# Altium schematic sheet Rangefinders.SchDoc: [Untitled]
size A3; Author: Nędzny Janusz; CompanyName: SensDx S.A.; Organization: SensDx S.A.; Address1: Wrocław Laboratories; SheetNumber: 1; SheetTotal: 1
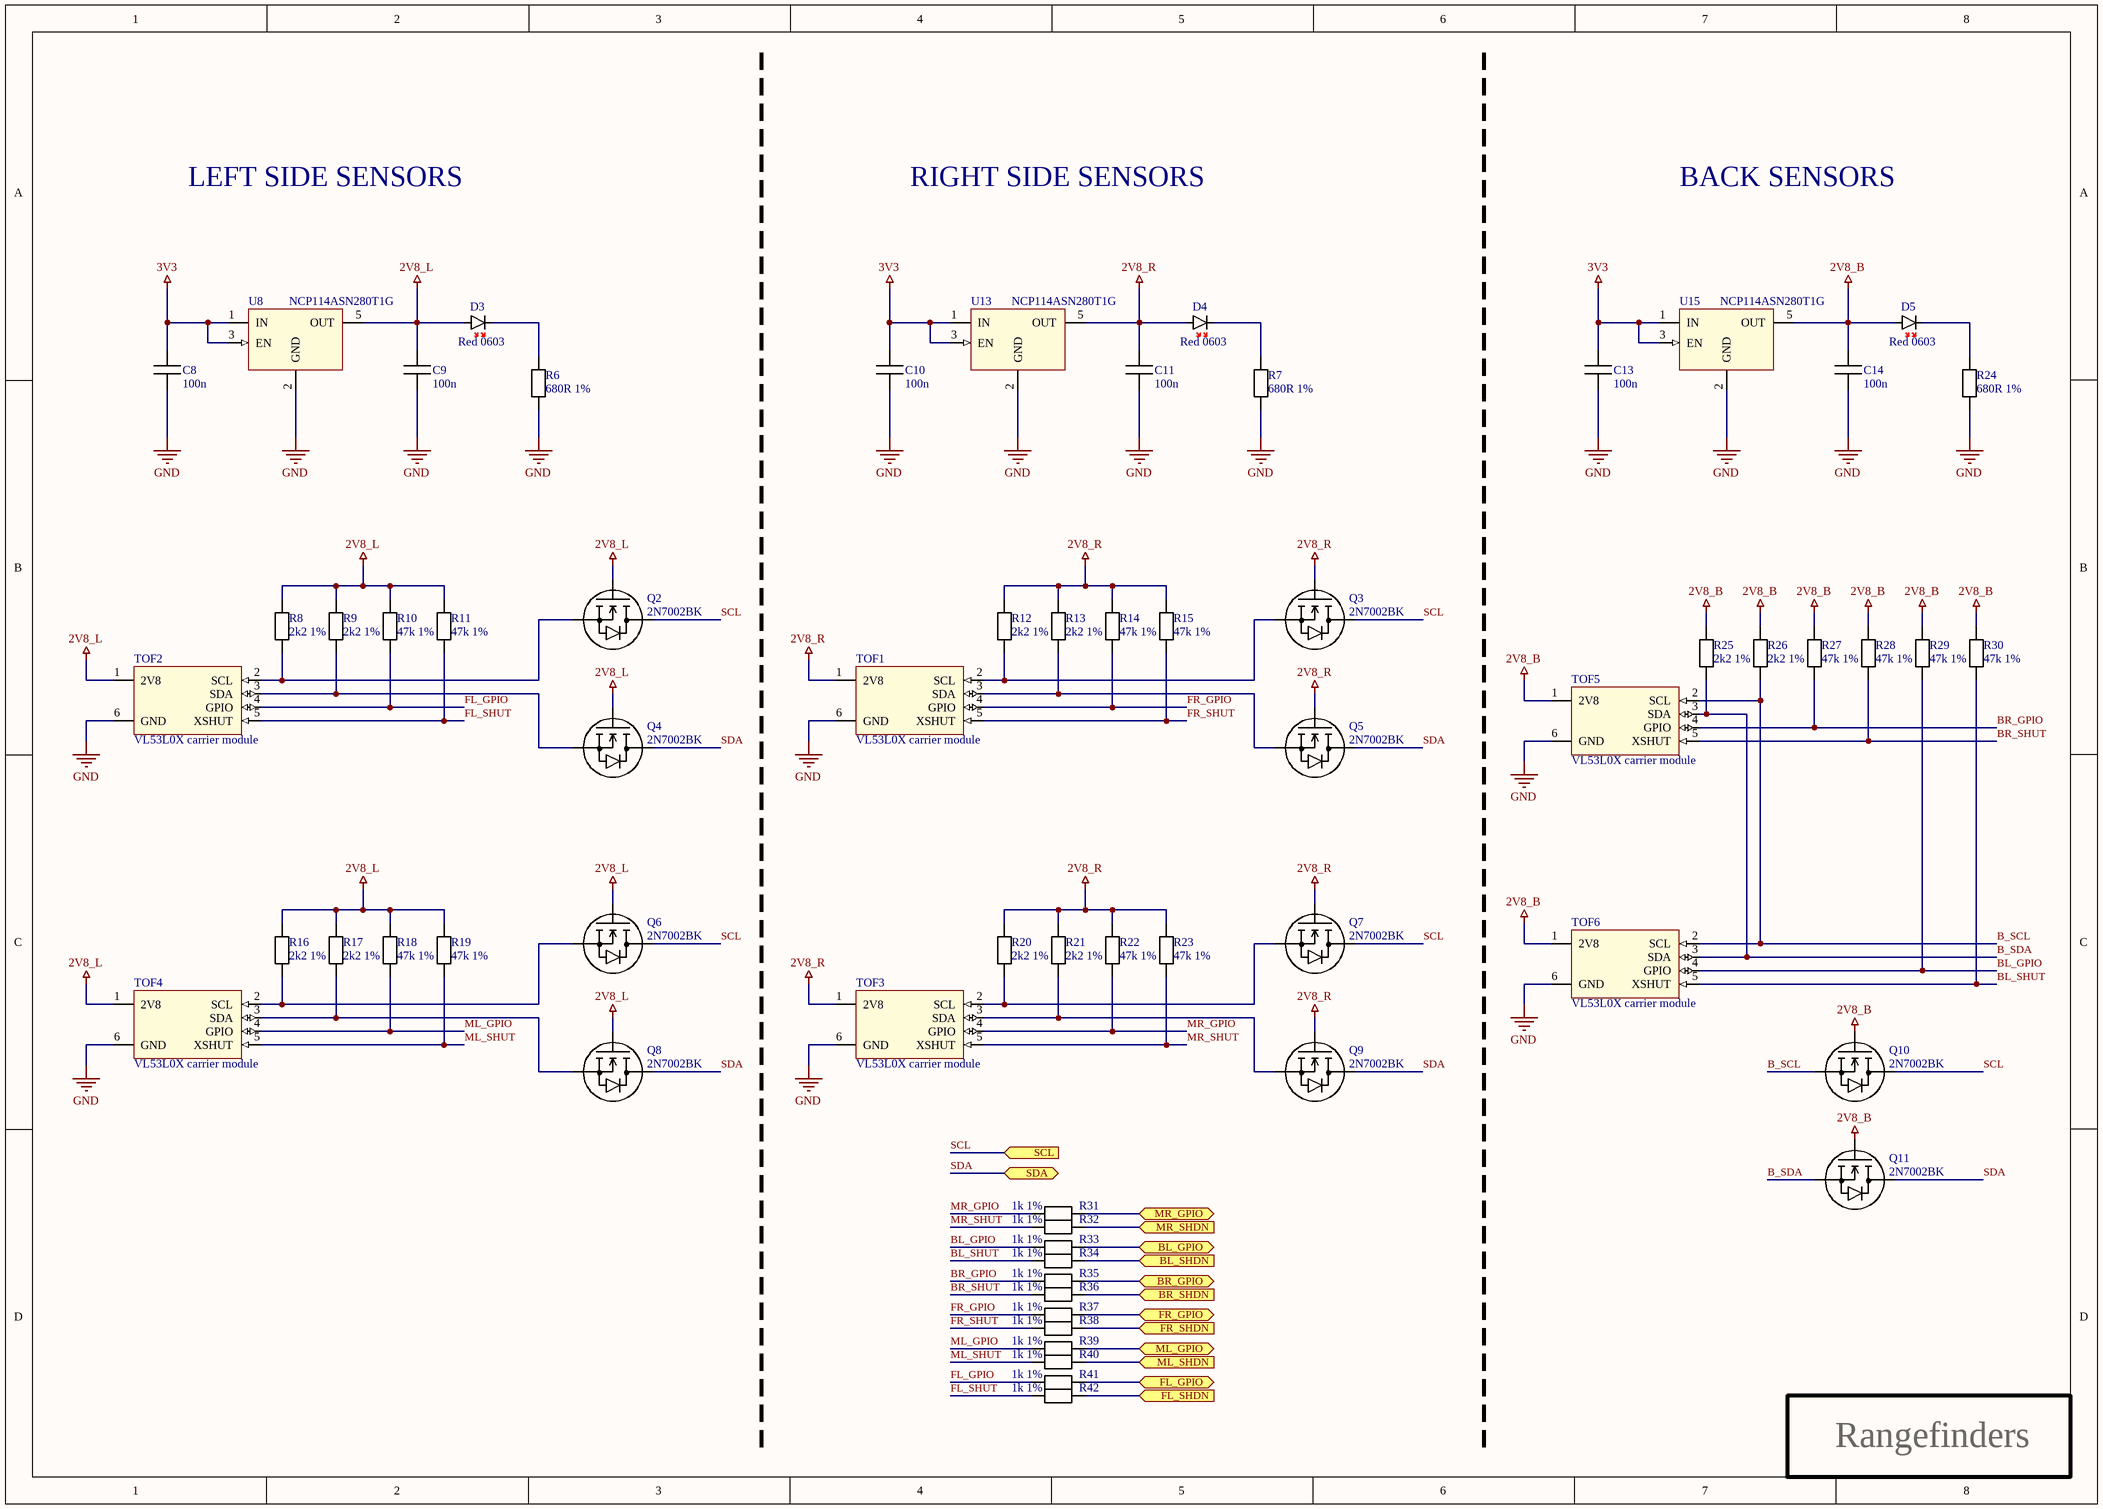
[diagram p0: Rangefinders.SchDoc]

## Parts
C8  100n  [C_0603_AUTO]
C9  100n  [C_0603_AUTO]
C10  100n  [C_0603_AUTO]
C11  100n  [C_0603_AUTO]
C13  100n  [C_0603_AUTO]
C14  100n  [C_0603_AUTO]
D3  Red 0603  [LED_0603_AUTO]
D4  Red 0603  [LED_0603_AUTO]
D5  Red 0603  [LED_0603_AUTO]
Q2  2N7002BK  [SOT23-3_AUTO]
Q3  2N7002BK  [SOT23-3_AUTO]
Q4  2N7002BK  [SOT23-3_AUTO]
Q5  2N7002BK  [SOT23-3_AUTO]
Q6  2N7002BK  [SOT23-3_AUTO]
Q7  2N7002BK  [SOT23-3_AUTO]
Q8  2N7002BK  [SOT23-3_AUTO]
Q9  2N7002BK  [SOT23-3_AUTO]
Q10  2N7002BK  [SOT23-3_AUTO]
Q11  2N7002BK  [SOT23-3_AUTO]
R6  680R 1%  [R_0603_AUTO]
R7  680R 1%  [R_0603_AUTO]
R8  2k2 1%  [R_0603_AUTO]
R9  2k2 1%  [R_0603_AUTO]
R10  47k 1%  [R_0603_AUTO]
R11  47k 1%  [R_0603_AUTO]
R12  2k2 1%  [R_0603_AUTO]
R13  2k2 1%  [R_0603_AUTO]
R14  47k 1%  [R_0603_AUTO]
R15  47k 1%  [R_0603_AUTO]
R16  2k2 1%  [R_0603_AUTO]
R17  2k2 1%  [R_0603_AUTO]
R18  47k 1%  [R_0603_AUTO]
R19  47k 1%  [R_0603_AUTO]
R20  2k2 1%  [R_0603_AUTO]
R21  2k2 1%  [R_0603_AUTO]
R22  47k 1%  [R_0603_AUTO]
R23  47k 1%  [R_0603_AUTO]
R24  680R 1%  [R_0603_AUTO]
R25  2k2 1%  [R_0603_AUTO]
R26  2k2 1%  [R_0603_AUTO]
R27  47k 1%  [R_0603_AUTO]
R28  47k 1%  [R_0603_AUTO]
R29  47k 1%  [R_0603_AUTO]
R30  47k 1%  [R_0603_AUTO]
R31  1k 1%  [R_0603_AUTO]
R32  1k 1%  [R_0603_AUTO]
R33  1k 1%  [R_0603_AUTO]
R34  1k 1%  [R_0603_AUTO]
R35  1k 1%  [R_0603_AUTO]
R36  1k 1%  [R_0603_AUTO]
R37  1k 1%  [R_0603_AUTO]
R38  1k 1%  [R_0603_AUTO]
R39  1k 1%  [R_0603_AUTO]
R40  1k 1%  [R_0603_AUTO]
R41  1k 1%  [R_0603_AUTO]
R42  1k 1%  [R_0603_AUTO]
TOF1  VL53L0X carrier module  [VL53L0X_module]
TOF2  VL53L0X carrier module  [VL53L0X_module]
TOF3  VL53L0X carrier module  [VL53L0X_module]
TOF4  VL53L0X carrier module  [VL53L0X_module]
TOF5  VL53L0X carrier module  [VL53L0X_module]
TOF6  VL53L0X carrier module  [VL53L0X_module]
U8  NCP114ASN280T1G  [TSOP-5_AUTO]
U13  NCP114ASN280T1G  [TSOP-5_AUTO]
U15  NCP114ASN280T1G  [TSOP-5_AUTO]

## Ports
BL_GPIO (bidir), BL_SHDN (in), BR_GPIO (bidir), BR_SHDN (in), FL_GPIO (bidir), FL_SHDN (in), FR_GPIO (bidir), FR_SHDN (in), ML_GPIO (bidir), ML_SHDN (in), MR_GPIO (bidir), MR_SHDN (in), SCL (in), SDA (bidir)

## Nets
2V8_B: C14.2 D5.2(A) Q10.1(G) Q11.1(G) R25.2 R26.2 R27.2 R28.2 R29.2 R30.2 TOF5.1(2V8) TOF6.1(2V8) U15.5(OUT)
2V8_L: C9.2 D3.2(A) Q2.1(G) Q4.1(G) Q6.1(G) Q8.1(G) R8.2 R9.2 R10.2 R11.2 R16.2 R17.2 R18.2 R19.2 TOF2.1(2V8) TOF4.1(2V8) U8.5(OUT)
2V8_R: C11.2 D4.2(A) Q3.1(G) Q5.1(G) Q7.1(G) Q9.1(G) R12.2 R13.2 R14.2 R15.2 R20.2 R21.2 R22.2 R23.2 TOF1.1(2V8) TOF3.1(2V8) U13.5(OUT)
3V3: C8.2 C10.2 C13.2 U8.1(IN) U8.3(EN) U13.1(IN) U13.3(EN) U15.1(IN) U15.3(EN)
GND: C8.1 C9.1 C10.1 C11.1 C13.1 C14.1 R6.1 R7.1 R24.1 TOF1.6(GND) TOF2.6(GND) TOF3.6(GND) TOF4.6(GND) TOF5.6(GND) TOF6.6(GND) U8.2(GND) U13.2(GND) U15.2(GND)
B_SCL: Q10.2(S) R26.1 TOF5.2(SCL) TOF6.2(SCL)
B_SDA: Q11.2(S) R25.1 TOF5.3(SDA) TOF6.3(SDA)
BL_GPIO: R29.1 R33.2 TOF6.4(GPIO)
BL_GPIO: R33.1 ; port BL_GPIO  [a separate net that carries the same name]
BL_SHDN: R34.1 ; port BL_SHDN
BL_SHUT: R30.1 R34.2 TOF6.5(XSHUT)
BR_GPIO: R27.1 R35.2 TOF5.4(GPIO)
BR_GPIO: R35.1 ; port BR_GPIO  [a separate net that carries the same name]
BR_SHDN: R36.1 ; port BR_SHDN
BR_SHUT: R28.1 R36.2 TOF5.5(XSHUT)
FL_GPIO: R10.1 R41.2 TOF2.4(GPIO)
FL_GPIO: R41.1 ; port FL_GPIO  [a separate net that carries the same name]
FL_SHDN: R42.1 ; port FL_SHDN
FL_SHUT: R11.1 R42.2 TOF2.5(XSHUT)
FR_GPIO: R14.1 R37.2 TOF1.4(GPIO)
FR_GPIO: R37.1 ; port FR_GPIO  [a separate net that carries the same name]
FR_SHDN: R38.1 ; port FR_SHDN
FR_SHUT: R15.1 R38.2 TOF1.5(XSHUT)
ML_GPIO: R18.1 R39.2 TOF4.4(GPIO)
ML_GPIO: R39.1 ; port ML_GPIO  [a separate net that carries the same name]
ML_SHDN: R40.1 ; port ML_SHDN
ML_SHUT: R19.1 R40.2 TOF4.5(XSHUT)
MR_GPIO: R22.1 R31.2 TOF3.4(GPIO)
MR_GPIO: R31.1 ; port MR_GPIO  [a separate net that carries the same name]
MR_SHDN: R32.1 ; port MR_SHDN
MR_SHUT: R23.1 R32.2 TOF3.5(XSHUT)
SCL: Q2.3(D) Q3.3(D) Q6.3(D) Q7.3(D) Q10.3(D) ; port SCL
SDA: Q4.3(D) Q5.3(D) Q8.3(D) Q9.3(D) Q11.3(D) ; port SDA
NetD3_1: D3.1(C) R6.2
NetD4_1: D4.1(C) R7.2
NetD5_1: D5.1(C) R24.2
NetQ2_2: Q2.2(S) R8.1 TOF2.2(SCL)
NetQ3_2: Q3.2(S) R12.1 TOF1.2(SCL)
NetQ4_2: Q4.2(S) R9.1 TOF2.3(SDA)
NetQ5_2: Q5.2(S) R13.1 TOF1.3(SDA)
NetQ6_2: Q6.2(S) R16.1 TOF4.2(SCL)
NetQ7_2: Q7.2(S) R20.1 TOF3.2(SCL)
NetQ8_2: Q8.2(S) R17.1 TOF4.3(SDA)
NetQ9_2: Q9.2(S) R21.1 TOF3.3(SDA)

Not connected (* = marked no-connect by the designer): U8 4(NC); U13 4(NC); U15 4(NC)

## Notes on the sheet
- LEFT SIDE SENSORS
- RIGHT SIDE SENSORS
- BACK SENSORS
- Rangefinders
- Title:
- Project name:
- Last modification:
- Author:
- Version control rev.:
- Sheet:
- /
- Sheet size:
- Variant:
- File name:
- A3
- Altium build:

## Library data of the parts
C8-C11 C13 C14 = Capacitor: Manufacturer: [Generic]; MPN: [Generic]; Value: 100n
D3-D5 = LED_Red_0603: Generic Red 0603; MPN: [Generic]; Value: Red; Manufacturer: [Generic]
Q2-Q11 = 2N7002BK: 60 V, 350 mA N-channel Trench MOSFET Vth=1.6V; Manufacturer: Nexperia; Value: NA; MPN: 2N7002BK; ComponentLink1Description: Datasheet; ComponentLink1URL: https://assets.nexperia.com/documents/data-sheet/2N7002BK.pdf; Supplier 1: Mouser; Supplier 2: Digi-Key; Supplier Part Number 1: 771-2N7002BK215; Supplier Part Number 2: 1727-4789-2-ND
R6-R42 = Resistor: MPN: [Generic]; Manufacturer: [Generic]
  R6 R7 R24: Value: 680R 1%
  R8 R9 R12 R13 R16 R17 R20 R21 R25 R26: Value: 2k2 1%
  R10 R11 R14 R15 R18 R19 R22 R23 R27-R30: Value: 47k 1%
  R31-R42: Value: 1k 1%
TOF1-TOF6 = VL53L0X_module: Custom VL53L0X sensor carrier module; Manufacturer: NA; Value: NA; MPN: NA; ComponentLink1Description: Sensor Datasheet; ComponentLink1URL: https://www.st.com/resource/en/datasheet/vl53l0x.pdf; ComponentLink2Description: Sensor product page; ComponentLink2URL: https://www.st.com/en/imaging-and-photonics-solutions/vl53l0x.html
U8 U13 U15 = NCP114ASN280T1G: LDO fixed 2V8 low noise; Manufacturer: ON Semi; Value: NA; MPN: NCP114ASN280T1G; ComponentLink1Description: Datasheet; ComponentLink1URL: http://www.onsemi.com/pub/Collateral/NCP114-D.PDF; Supplier 1: Digi-Key; Supplier 2: Farnell; Supplier 3: Mouser; Supplier Part Number 1: NCP114ASN280T1GOSDKR-ND; Supplier Part Number 3: 863-NCP114ASN280T1G; Supplier Part Number 2: 2677149